# EAGLE design seeknobs6_28Apr2022 (EAGLE 9.6.2)
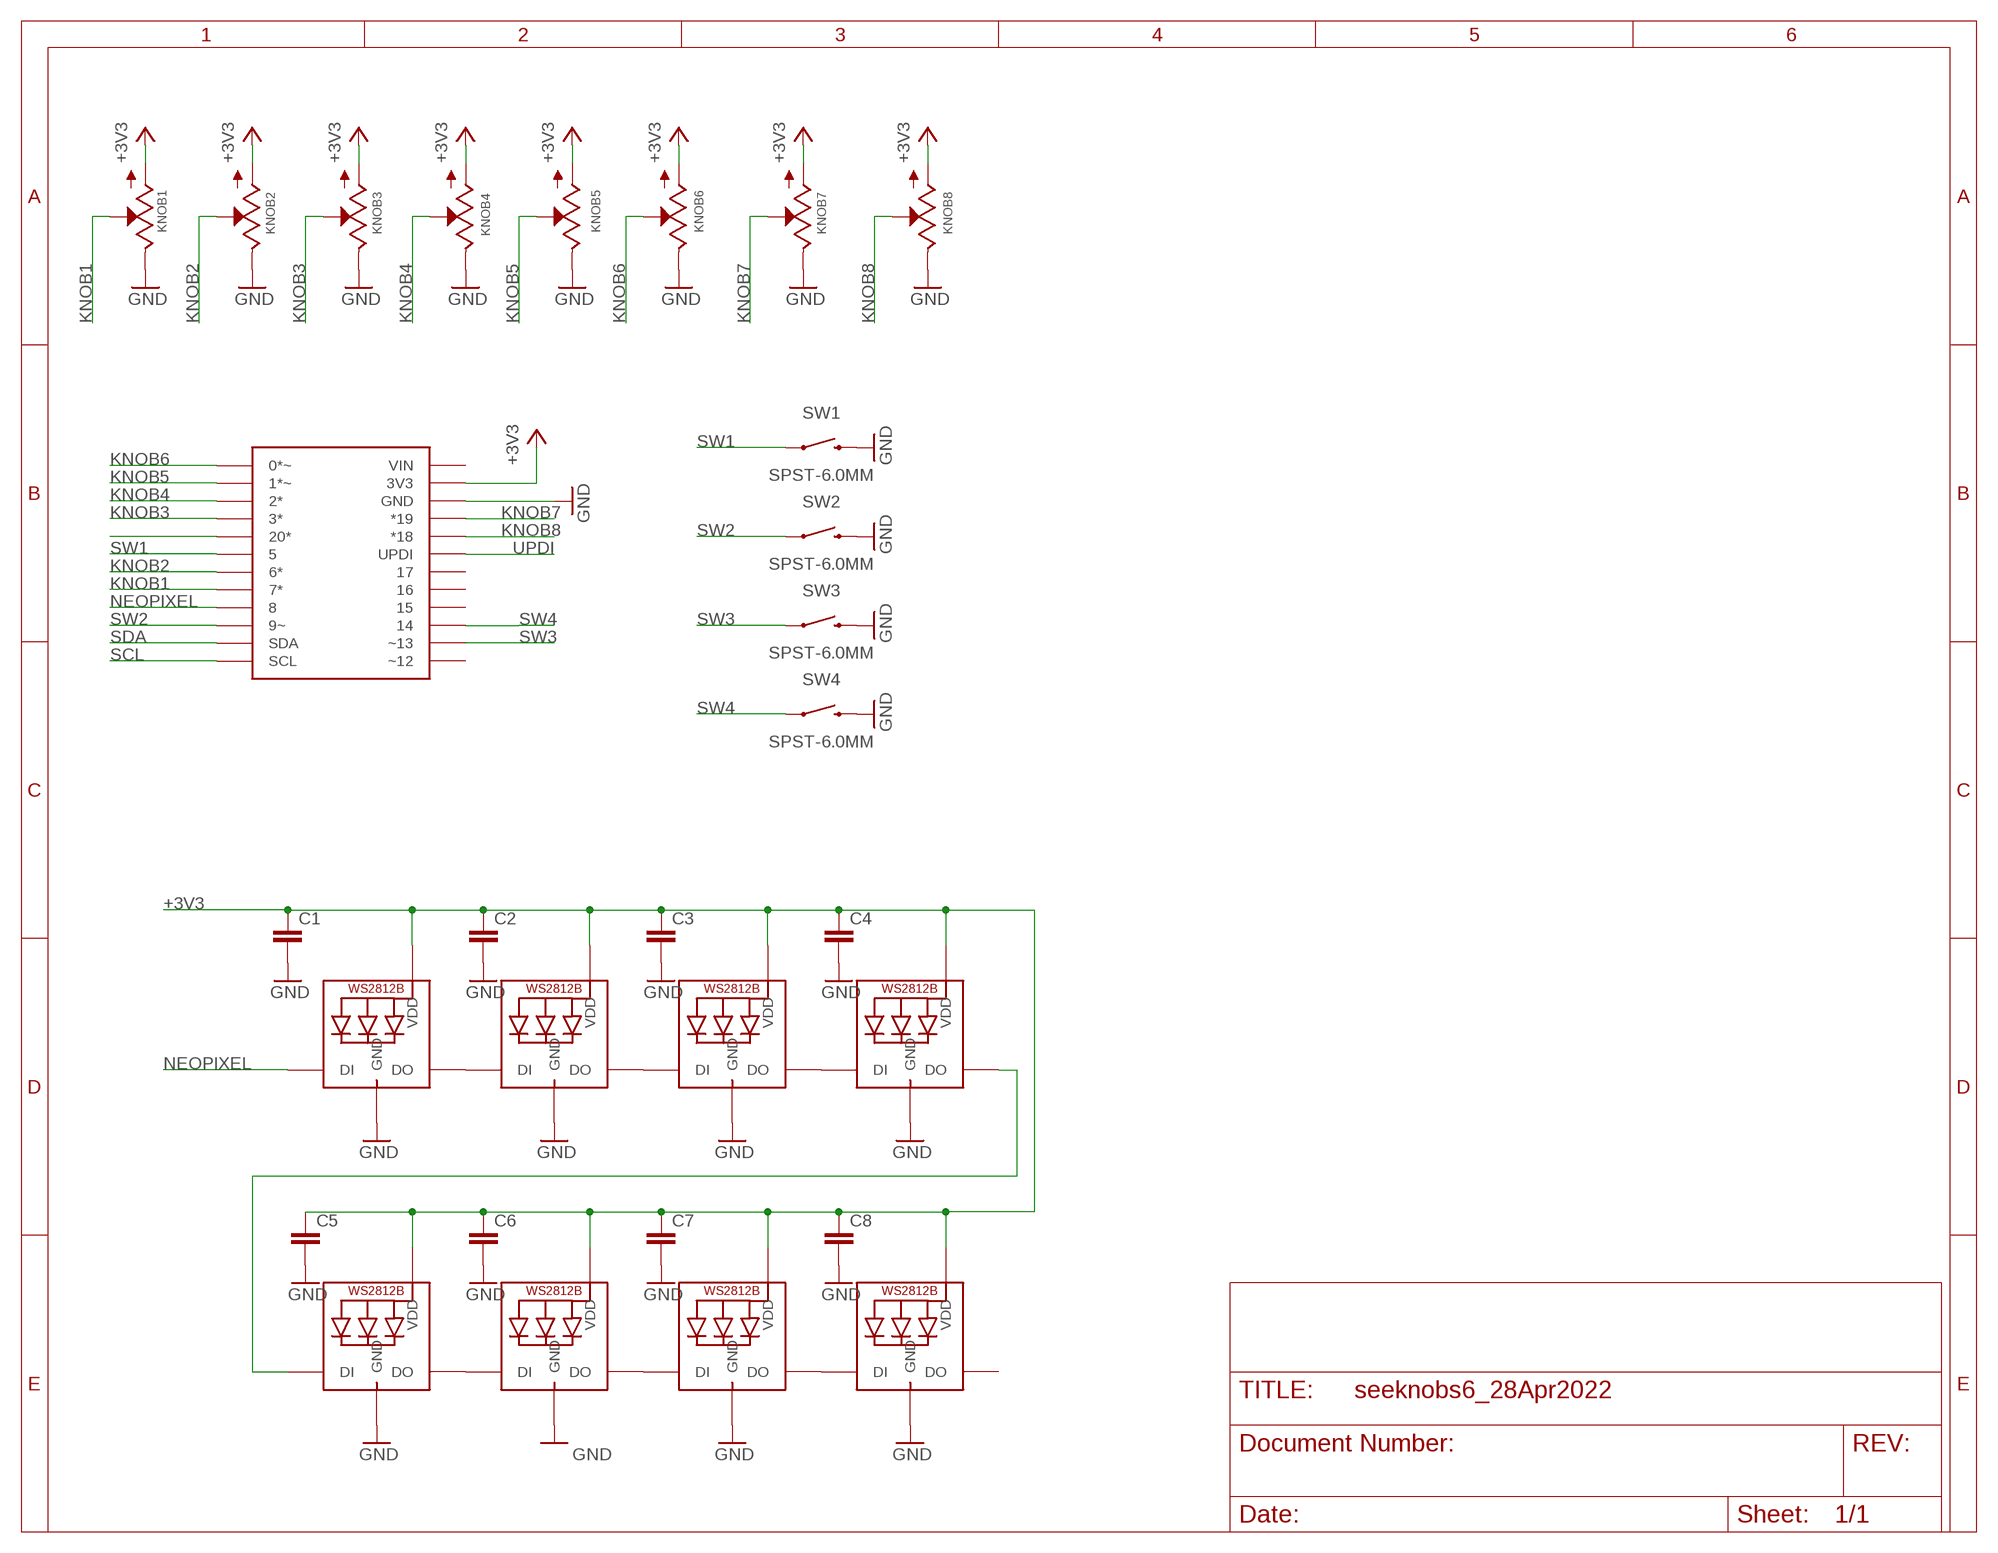
[diagram p0: schematic, sheet 1]

## Parts
C1  C-EUC0805  [C0805]
C2  C-EUC0805  [C0805]
C3  C-EUC0805  [C0805]
C4  C-EUC0805  [C0805]
C5  C-EUC0805  [C0805]
C6  C-EUC0805  [C0805]
C7  C-EUC0805  [C0805]
C8  C-EUC0805  [C0805]
KNOB1  POT  [ALPS_POT]
KNOB2  POT  [ALPS_POT]
KNOB3  POT  [ALPS_POT]
KNOB4  POT  [ALPS_POT]
KNOB5  POT  [ALPS_POT]
KNOB6  POT  [ALPS_POT]
KNOB7  POT  [ALPS_POT]
KNOB8  POT  [ALPS_POT]
LED1  WS2812B5050EZ  [WS2812B-EASY]
LED2  WS2812B5050EZ  [WS2812B-EASY]
LED3  WS2812B5050EZ  [WS2812B-EASY]
LED4  WS2812B5050EZ  [WS2812B-EASY]
LED5  WS2812B5050EZ  [WS2812B-EASY]
LED6  WS2812B5050EZ  [WS2812B-EASY]
LED7  WS2812B5050EZ  [WS2812B-EASY]
LED8  WS2812B5050EZ  [WS2812B-EASY]
SEESAW  ADAFRUIT_SEESAW_ATTINY817  [ADAFRUIT_SEESAW_ATTINY817]
SW1  SPST-6.0MM  MOMENTARY-SWITCH-SPST-PTH-6.0MM  [TACTILE_SWITCH_PTH_6.0MM]
SW2  SPST-6.0MM  MOMENTARY-SWITCH-SPST-PTH-6.0MM  [TACTILE_SWITCH_PTH_6.0MM]
SW3  SPST-6.0MM  MOMENTARY-SWITCH-SPST-PTH-6.0MM  [TACTILE_SWITCH_PTH_6.0MM]
SW4  SPST-6.0MM  MOMENTARY-SWITCH-SPST-PTH-6.0MM  [TACTILE_SWITCH_PTH_6.0MM]

## Nets
+3V3: C1.1 C2.1 C3.1 C4.1 C5.1 C6.1 C7.1 C8.1 KNOB1.P$3(A) KNOB2.P$3(A) KNOB3.P$3(A) KNOB4.P$3(A) KNOB5.P$3(A) KNOB6.P$3(A) KNOB7.P$3(A) KNOB8.P$3(A) LED1.1-VDD(VDD) LED2.1-VDD(VDD) LED3.1-VDD(VDD) LED4.1-VDD(VDD) LED5.1-VDD(VDD) LED6.1-VDD(VDD) LED7.1-VDD(VDD) LED8.1-VDD(VDD) SEESAW.P23(3V3)
GND: C1.2 C2.2 C3.2 C4.2 C5.2 C6.2 C7.2 C8.2 KNOB1.P$1(E) KNOB2.P$1(E) KNOB3.P$1(E) KNOB4.P$1(E) KNOB5.P$1(E) KNOB6.P$1(E) KNOB7.P$1(E) KNOB8.P$1(E) LED1.3-GND(GND) LED2.3-GND(GND) LED3.3-GND(GND) LED4.3-GND(GND) LED5.3-GND(GND) LED6.3-GND(GND) LED7.3-GND(GND) LED8.3-GND(GND) SEESAW.P22(GND) SW1.3 SW2.3 SW3.3 SW4.3
KNOB1: KNOB1.P$2(S) SEESAW.P8(7*)
KNOB2: KNOB2.P$2(S) SEESAW.P7(6*)
KNOB3: KNOB3.P$2(S) SEESAW.P4(3*)
KNOB4: KNOB4.P$2(S) SEESAW.P3(2*)
KNOB5: KNOB5.P$2(S) SEESAW.P2(1*~)
KNOB6: KNOB6.P$2(S) SEESAW.0(0*~)
KNOB7: KNOB7.P$2(S) SEESAW.P21(*19)
KNOB8: KNOB8.P$2(S) SEESAW.P20(*18)
N$1: LED2.2-DOUT(DO) LED3.4-DIN(DI)
N$2: LED3.2-DOUT(DO) LED4.4-DIN(DI)
N$3: LED1.2-DOUT(DO) LED2.4-DIN(DI)
N$4: LED5.2-DOUT(DO) LED6.4-DIN(DI)
N$5: LED6.2-DOUT(DO) LED7.4-DIN(DI)
N$6: LED7.2-DOUT(DO) LED8.4-DIN(DI)
N$7: LED4.2-DOUT(DO) LED5.4-DIN(DI)
N$12: SEESAW.P5(20*)
NEOPIXEL: LED1.4-DIN(DI) SEESAW.P9
SCL: SEESAW.P12(SCL)
SDA: SEESAW.P11(SDA)
SW1: SEESAW.P6 SW1.1
SW2: SEESAW.P10(9~) SW2.1
SW3: SEESAW.P14(~13) SW3.1
SW4: SEESAW.P15 SW4.1
UPDI: SEESAW.P19(UPDI)
Unconnected: LED8.2-DOUT(DO) SEESAW.P13(~12) SEESAW.P16 SEESAW.P17 SEESAW.P18 SEESAW.P24(VIN)

## Library data of the parts
C1-C8 = rcl:C-EU: CAPACITOR, European symbol; SPICEPREFIX: C
KNOB1-KNOB8 = EurorackModularParts:POT
LED1-LED8 = todstuff:WS2812B
SEESAW = todstuff:ADAFRUIT_SEESAW_ATTINY817
SW1-SW4 = SparkFun-Switches:MOMENTARY-SWITCH-SPST: Momentary Switch (Pushbutton) - SPST Normally-open (NO) SPST momentary switches (buttons, pushbuttons). Variants PTH-12MM - 12mm square, through-hole Momentary Pushbutton Switch - 12mm Square <https://www.sparkfun.com/products/9190> (COM-09190) PTH-6.0MM, PTH-6.0MM-KIT - 6.0mm square, through-hole Mini Pushbutton Switch <https://www.sparkfun.com/products/97> (COM-00097) KIT package intended for soldering kit's - only one side of pads' copper is exposed. PTH-RIGHT-ANGLE-KIT - Right-angle, through-hole Right Angle Tactile Button <https://www.sparkfun.com/products/10791> - Used on SparkFun BigTime Watch Kit <https://www.sparkfun.com/products/11734> SMD-12MM - 12mm square, surface-mount Tactile Button - SMD (12mm) <https://www.sparkfun.com/products/12993> (COM-12993) Used on SparkFun PicoBoard <https://www.sparkfun.com/products/11888> SMD-4.5MM - 4.5mm Square Trackball Switch Used on SparkFun Blackberry Trackballer Breakout <https://www.sparkfun.com/products/13169> SMD-4.6MMX2.8MM - 4.60mm x 2.80mm, surface mount Used on SparkFun SAMD21 Mini Breakout <https://www.sparkfun.com/products/13664> SMD-5.2MM, SMD-5.2-REDUNDANT - 5.2mm square, surface-mount Mini Pushbutton Switch - SMD <https://www.sparkfun.com/products/8720> (COM-08720) Used on Arduino Pro Mini <https://www.sparkfun.com/products/11114> REDUNDANT package connects both switch circuits together SMD-6.0X3.5MM - 6.0 x 3.5mm, surface mount Momentary Reset Switch SMD <https://www.sparkfun.com/products/8229> (COM-08229) SMD-6.2MM-TALL - 6.2mm square, surface mount Tactile Button - SMD (6mm) <https://www.sparkfun.com/products/12992> Used on SparkFun Digital Sandbox <https://www.sparkfun.com/products/12651> SMD-RIGHT-ANGLE - Right-angle, surface mount Used on SparkFun Block for Intel® Edison - Arduino <https://www.sparkfun.com/products/13036>; PROD_ID: SWCH-08441; SF_SKU: COM-00097

## Board
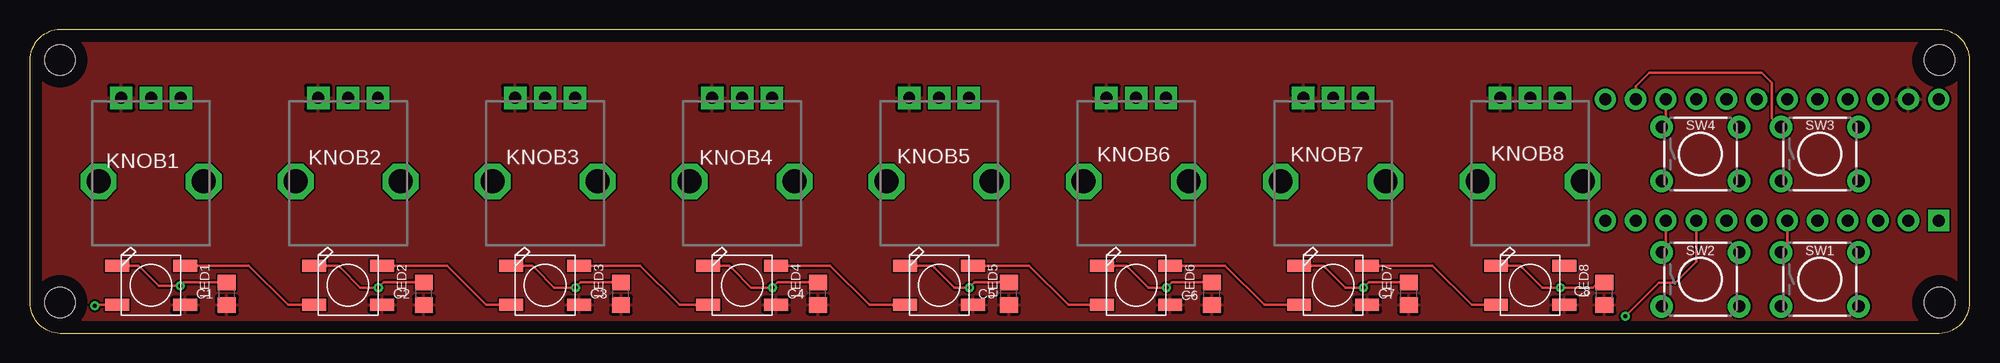
[diagram p1: board, top side]
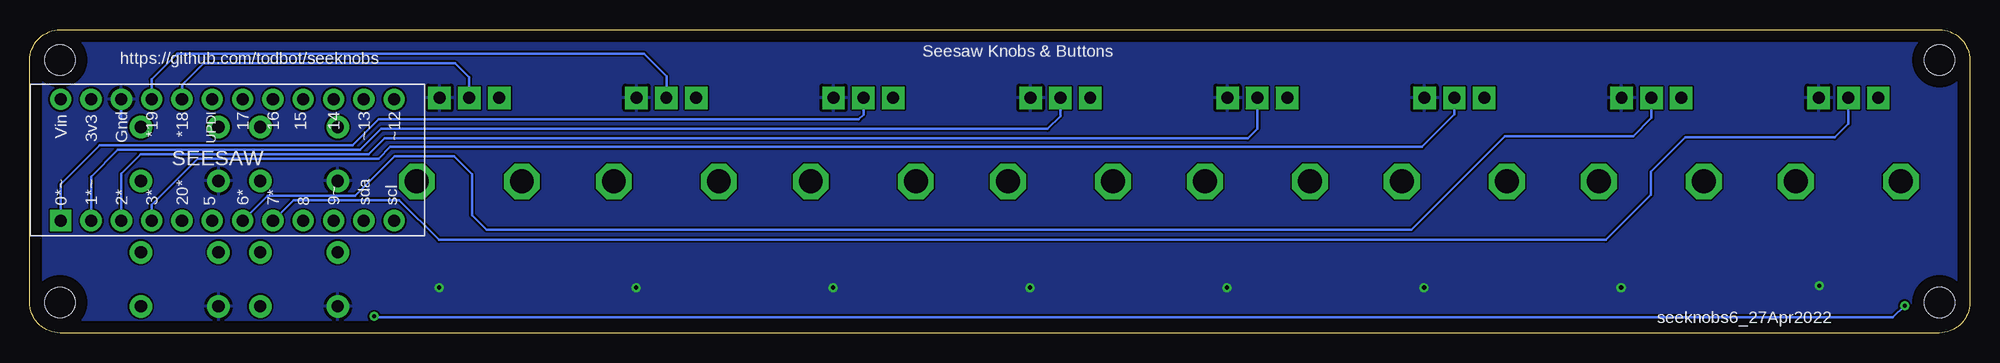
[diagram p2: board, bottom side, seen from below]

Size 162.56 x 25.4 mm. Coordinates in mm from the lower left corner, seen from the top.
Outline: 0,22.86 0,2.54 arc90 2.54,0 160.02,0 arc90 162.56,2.54 162.56,22.86 arc90 160.02,25.4 2.54,25.4 arc90 0,22.86
Copper layers (1*16): Top 0.035mm / dielectric 1.5mm / Bottom 0.035mm
Design rules "default": minimum track width 6mil, minimum drill 0.35mm, track to track 6mil, track to pad 6mil, pad to pad 6mil, via to via 6mil, smd to smd 6mil, copper to edge 40mil, drill to drill 6mil, minimum pad ring 10mil, minimum via ring 8mil, stop-mask expansion 4mil, vias tented up to drill 0mil, thermal gap 10mil
Holes 2.54 mm at 160.02,22.86 160.02,2.54 2.54,2.54 2.54,22.86

### Footprints (pad centres in the part's own frame; a part is rotated, then mirrored left to right if it is on the bottom)
C0805 = smd 1.3 x 1.5: 1 -0.95,0; 2 0.95,0
ALPS_POT = drill 1 pad 1.88 square: P$1 7,-2.5; P$2 7,0; P$3 7,2.5 | drill 2 octagon: P$4 0,-4.4; P$5 0,4.4
WS2812B-EASY = smd 2 x 1: 1-VDD 2.85,-1.65; 2-DOUT 2.85,1.65; 3-GND -2.85,1.65; 4-DIN -2.85,-1.65
ADAFRUIT_SEESAW_ATTINY817 = drill 1.016 pad 1.778 square: 0 -5.08,13.97 | drill 1.016 pad 1.778: P2 -5.08,11.43; P3 -5.08,8.89; P4 -5.08,6.35; P5 -5.08,3.81; P6 -5.08,1.27; P7 -5.08,-1.27; P8 -5.08,-3.81; P9 -5.08,-6.35; P10 -5.08,-8.89; P11 -5.08,-11.43; P12 -5.08,-13.97; P13 5.08,-13.97; P14 5.08,-11.43; P15 5.08,-8.89; P16 5.08,-6.35; P17 5.08,-3.81; P18 5.08,-1.27; P19 5.08,1.27; P20 5.08,3.81; P21 5.08,6.35; P22 5.08,8.89; P23 5.08,11.43; P24 5.08,13.97
TACTILE_SWITCH_PTH_6.0MM = drill 1.016 pad 1.88: 1 -3.251,2.261; 2 3.251,2.261; 3 -3.251,-2.261; 4 3.251,-2.261

### Placement (x,y rotation side)
C1  16.51,3.3 90 top
C2  33.02,3.3 90 top
C3  49.53,3.3 90 top
C4  66.04,3.3 90 top
C5  82.04,3.3 90 top
C6  99.06,3.3 90 top
C7  115.57,3.3 90 top
C8  131.95,3.3 90 top
KNOB1  10.16,12.7 90 top
KNOB2  26.67,12.7 90 top
KNOB3  43.18,12.7 90 top
KNOB4  59.69,12.7 90 top
KNOB5  76.2,12.7 90 top
KNOB6  92.71,12.7 90 top
KNOB7  109.22,12.7 90 top
KNOB8  125.73,12.7 90 top
LED1  10.16,4 0 top
LED2  26.67,4 0 top
LED3  43.18,4 0 top
LED4  59.69,4 0 top
LED5  76.2,4 0 top
LED6  92.71,4 0 top
LED7  109.22,4 0 top
LED8  125.73,4 0 top
SEESAW  146,14.5 90 bottom
SW1  150,4.5 0 top
SW2  140,4.5 0 top
SW3  150,15 0 top
SW4  140,15 0 top

### Tracks (layer width: path | path; a pad name or v marks a point on that pad's centre or on a via)
+3V3
  pour Top: 165.1,26.67 165.1,-1.02 -1.4,-1.02 -1.4,26.67
GND  (via drill 0.35)
  Top 0.2: LED1.3-GND 9.08,5.65 9.27,5.46 | 26.04,5.46 25.85,5.65 LED2.3-GND | 42.33,5.43 42.1,5.65 LED3.3-GND | 58.83,5.43 58.61,5.65 LED4.3-GND | 75.82,5.46 75.63,5.65 LED5.3-GND | 92.08,5.46 91.89,5.65 LED6.3-GND | 108.59,5.46 108.4,5.65 LED7.3-GND | 125.1,5.46 124.91,5.65 LED8.3-GND
  Top 0.203: 9.27,5.46 10.78,3.95 v12.6,3.95 v12.61,3.95 12.91,4.25 C1.2 | 26.04,5.46 27.69,3.81 v29.21,3.81 29.65,4.25 C2.2 | 42.29,5.46 42.33,5.43 43.94,3.81 v45.72,3.81 46.16,4.25 C3.2 | 58.8,5.46 58.83,5.43 60.45,3.81 v62.23,3.81 62.67,4.25 C4.2 | 75.82,5.46 77.47,3.81 v78.74,3.81 79.18,4.25 C5.2 | 92.08,5.46 93.73,3.81 v95.25,3.81 95.69,4.25 C6.2 | 108.59,5.46 110.24,3.81 v111.76,3.81 112.2,4.25 C7.2 | 125.1,5.46 126.75,3.81 v128.27,3.81 130.97,3.81 131.41,4.25 C8.2
  Bottom 0.203: 154.89,17.93 SEESAW.P22
  pour Bottom: -2.37,26.67 163.83,26.67 163.83,-1.02 -2.37,-1.02
KNOB1
  Bottom 0.203: KNOB1.P$2 10.16,17.53 11.3,16.38 23.82,16.38 26.7,13.5 26.7,11.6 30.5,7.8 128.27,7.8 131.6,11.13 140.47,11.13 142.18,9.42 SEESAW.P8
KNOB2
  Bottom 0.2: 124.3,8.67 125.5,9.87 125.5,13.3 127,14.8 132,14.8 135.29,11.51 142.64,11.51
  Bottom 0.203: 124.3,8.67 46.78,8.67 38.94,16.5 28.2,16.5 26.67,18.03 KNOB2.P$2 | SEESAW.P7 142.64,11.51
KNOB3
  Bottom 0.2: SEESAW.P4 152.35,10.75 148.48,14.62 133.33,14.62 132.35,15.6 130.5,15.6
  Bottom 0.203: 130.5,15.6 45.9,15.6 43.18,18.32 KNOB3.P$2
KNOB4
  Bottom 0.2: 134.18,14.97 132.84,16.31 60.49,16.31 59.69,17.11 KNOB4.P$2
  Bottom 0.203: 134.18,14.97 153.26,14.97 154.89,13.35 SEESAW.P3
KNOB5
  Bottom 0.203: KNOB5.P$2 76.2,18.18 77.26,17.11 133.11,17.11 134.87,15.35 155.18,15.35 157.43,13.1 SEESAW.P2
KNOB6
  Bottom 0.2: KNOB6.P$2 92.71,18.29 93.1,17.9 133.34,17.9
  Bottom 0.203: 133.34,17.9 135.5,15.73 156.71,15.73 159.97,12.47 SEESAW.0
KNOB7
  Bottom 0.2: KNOB7.P$2 109.22,21.52 111.1,23.4 150.2,23.4 152.35,21.25 SEESAW.P21
KNOB8
  Bottom 0.2: KNOB8.P$2 125.73,21.43 126.9,22.6 148,22.6 149.81,20.79 SEESAW.P20
N$1
  Top 0.2: LED2.2-DOUT 34.95,5.65 38.25,2.35 LED3.4-DIN
N$2
  Top 0.2: LED3.2-DOUT 51.15,5.65 54.45,2.35 LED4.4-DIN
N$3
  Top 0.2: LED1.2-DOUT 18.35,5.65 21.65,2.35 LED2.4-DIN
N$4
  Top 0.2: LED5.2-DOUT 83.75,5.65 87.05,2.35 LED6.4-DIN
N$5
  Top 0.2: LED6.2-DOUT 100.15,5.65 103.45,2.35 LED7.4-DIN
N$6
  Top 0.2: LED7.2-DOUT 117.55,5.65 120.85,2.35 LED8.4-DIN
N$7
  Top 0.2: LED4.2-DOUT 67.05,5.65 70.35,2.35 LED5.4-DIN
NEOPIXEL  (via drill 0.35)
  Top 0.2: SEESAW.P9 139.65,5.95 137.9,4.2 136.5,4.2 v133.7,1.4 v133.7,1.39 | v5.45,2.29 5.51,2.35 LED1.4-DIN
  Bottom 0.2: v5.45,2.29 6.44,1.3 133.7,1.3 v133.7,1.39
SW1
  Top 0.2: SEESAW.P6 147.27,7.28 SW1.1
SW2
  Top 0.2: SEESAW.P10 137.11,7.12 SW2.1
SW3
  Top 0.2: 145.85,21.1 146,20.95 146,18.01 SW3.1
  Top 0.203: 145.85,21.1 145.15,21.8 135.7,21.8 134.57,20.67 SEESAW.P14
SW4
  Top 0.203: SEESAW.P15 137.11,17.62 SW4.1

### Text on the board
bPlace: Seesaw Knobs & Buttons | https://github.com/todbot/seeknobs | seeknobs6_27Apr2022